# EAGLE design module_ESP07 (EAGLE 8.4.0)
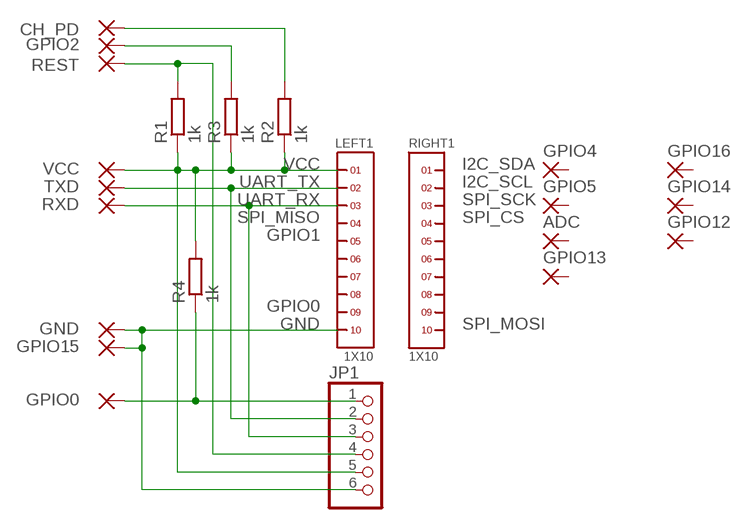
[diagram p0: schematic, sheet 1]

## Parts
ADC  WIREPADSMD1,27-254  [SMD1,27-2,54]
CH_PD  WIREPADSMD1,27-254  [SMD1,27-2,54]
GND  WIREPADSMD1,27-254  [SMD1,27-2,54]
GPIO0  WIREPADSMD1,27-254  [SMD1,27-2,54]
GPIO2  WIREPADSMD1,27-254  [SMD1,27-2,54]
GPIO4  WIREPADSMD1,27-254  [SMD1,27-2,54]
GPIO5  WIREPADSMD1,27-254  [SMD1,27-2,54]
GPIO12  WIREPADSMD1,27-254  [SMD1,27-2,54]
GPIO13  WIREPADSMD1,27-254  [SMD1,27-2,54]
GPIO14  WIREPADSMD1,27-254  [SMD1,27-2,54]
GPIO15  WIREPADSMD1,27-254  [SMD1,27-2,54]
GPIO16  WIREPADSMD1,27-254  [SMD1,27-2,54]
JP1  PINHD-1X6  [1X06]
LEFT1  1X10  [1X10]
R1  1k  R-EU_R0603  [R0603]
R2  1k  R-EU_R0603  [R0603]
R3  1k  R-EU_R0603  [R0603]
R4  1k  R-EU_R0603  [R0603]
REST  WIREPADSMD1,27-254  [SMD1,27-2,54]
RIGHT1  1X10  [1X10]
RXD  WIREPADSMD1,27-254  [SMD1,27-2,54]
TXD  WIREPADSMD1,27-254  [SMD1,27-2,54]
VCC  WIREPADSMD1,27-254  [SMD1,27-2,54]

## Nets
GND: GND.1(P) GPIO15.1(P) JP1.6 LEFT1.10
GPIO0: GPIO0.1(P) JP1.1 R4.1
N$1: GPIO2.1(P) R3.2
N$2: CH_PD.1(P) R2.2
RST: JP1.4 R1.2 REST.1(P)
UART_RX: JP1.3 LEFT1.3 RXD.1(P)
UART_TX: JP1.2 LEFT1.2 TXD.1(P)
VCC: JP1.5 LEFT1.1 R1.1 R2.1 R3.1 R4.2 VCC.1(P)
Unconnected: ADC.1(P) GPIO4.1(P) GPIO5.1(P) GPIO12.1(P) GPIO13.1(P) GPIO14.1(P) GPIO16.1(P) LEFT1.4 LEFT1.5 LEFT1.6 LEFT1.7 LEFT1.8 LEFT1.9 RIGHT1.1 RIGHT1.2 RIGHT1.3 RIGHT1.4 RIGHT1.5 RIGHT1.6 RIGHT1.7 RIGHT1.8 RIGHT1.9 RIGHT1.10

## Notes on the sheet
- VCC | I2C_SDA
- UART_TX | I2C_SCL
- UART_RX | SPI_SCK
- SPI_MISO | SPI_CS
- GPIO1
- GPIO0
- GND | SPI_MOSI

## Library data of the parts
ADC CH_PD GND GPIO0 GPIO2 GPIO4 GPIO5 GPIO12-GPIO16 REST RXD TXD VCC = wirepad:WIREPAD: Wire PAD connect wire on PCB
JP1 = pinhead:PINHD-1X6: PIN HEADER
LEFT1 RIGHT1 = headers(2mm):1X10
R1-R4 = rcl:R-EU_: RESISTOR, European symbol

## Board
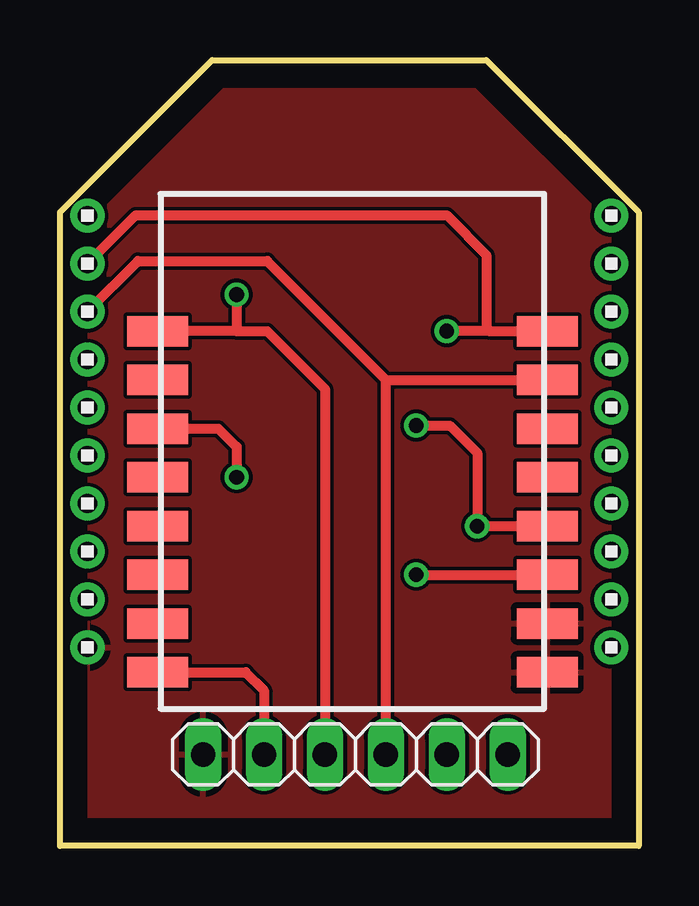
[diagram p1: board, top side]
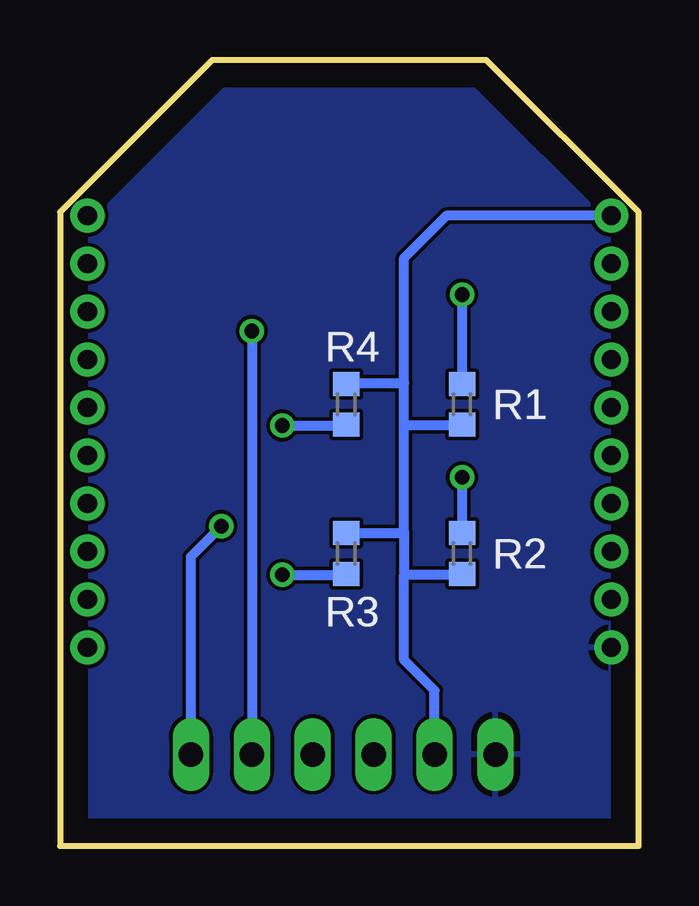
[diagram p2: board, bottom side, seen from below]

Size 24.13 x 32.77 mm. Coordinates in mm from the lower left corner, seen from the top.
Outline: 0,0 0,26.42 6.35,32.77 17.78,32.77 24.13,26.42 24.13,0 0,0
Copper layers (1*16): Top 0.035mm / dielectric 1.5mm / Bottom 0.035mm
Design rules "default": minimum track width 6mil, minimum drill 0.35mm, track to track 6mil, track to pad 6mil, pad to pad 6mil, via to via 6mil, smd to smd 6mil, copper to edge 40mil, drill to drill 6mil, minimum pad ring 10mil, minimum via ring 8mil, stop-mask expansion 4mil, vias tented up to drill 0mil, thermal gap 10mil

### Footprints (pad centres in the part's own frame; a part is rotated, then mirrored left to right if it is on the bottom)
SMD1,27-2,54 = smd 1.27 x 2.54: 1 0,0
1X06 = drill 1.016 long: 1 -6.35,0; 2 -3.81,0; 3 -1.27,0; 4 1.27,0; 5 3.81,0; 6 6.35,0
1X10 = drill 0.8 pad 1.422: 1 -9,0; 2 -7,0; 3 -5,0; 4 -3,0; 5 -1,0; 6 1,0; 7 3,0; 8 5,0; 9 7,0; 10 9,0
R0603 = smd 1 x 1.1: 1 -0.85,0; 2 0.85,0

### Placement (x,y rotation side)
ADC  4.06,19.43 90 top
CH_PD  4.06,17.4 270 top
GND  20.32,7.24 90 top
GPIO0  20.32,13.33 270 top
GPIO2  20.32,11.3 270 top
GPIO4  20.32,17.4 270 top
GPIO5  20.32,15.37 270 top
GPIO12  4.06,11.3 270 top
GPIO13  4.06,9.27 90 top
GPIO14  4.06,13.33 270 top
GPIO15  20.32,9.27 90 top
GPIO16  4.06,15.37 270 top
JP1  12.32,3.81 180 top
LEFT1  1.14,17.27 270 top
R1  7.37,18.42 90 bottom
R2  7.37,12.19 90 bottom
R3  12.19,12.19 270 bottom
R4  12.19,18.42 90 bottom
REST  4.06,21.46 270 top
RIGHT1  22.99,17.27 270 top
RXD  20.32,19.43 270 top
TXD  20.32,21.46 270 top
VCC  4.06,7.24 270 top

### Tracks (layer width: path | path; a pad name or v marks a point on that pad's centre or on a via)
GND
  pour Top: -0.25,-0.25 24.38,-0.25 24.38,26.54 17.91,33.02 6.22,33.02 -0.25,26.54
  pour Bottom: -0.51,-0.51 24.64,-0.51 24.64,26.67 18.03,33.27 6.1,33.27 -0.51,26.67
GPIO0  (via drill 0.61)
  Top 0.406: GPIO0.1 v17.4,13.33 17.4,16.38 16.26,17.53 v14.86,17.53
  Bottom 0.406: JP1.1 18.67,12.06 v17.4,13.33 | v14.86,17.53 12.23,17.53 R4.1
N$1  (via drill 0.61)
  Top 0.406: v14.86,11.3 GPIO2.1
  Bottom 0.406: v14.86,11.3 12.23,11.3 R3.2
N$2  (via drill 0.61)
  Top 0.406: CH_PD.1 6.6,17.4 7.37,16.64 v7.37,15.37
  Bottom 0.406: v7.37,15.37 R2.2
RST  (via drill 0.61)
  Top 0.406: JP1.4 11.05,19.05 8.64,21.46 7.37,21.46 | 7.37,21.46 REST.1 | v7.37,22.99 7.37,21.46
  Bottom 0.406: v7.37,22.99 R1.2
UART_RX
  Top 0.406: 13.59,19.43 RXD.1 | JP1.3 13.59,19.43 | LEFT1.3 3.25,24.38 8.64,24.38 13.59,19.43
UART_TX  (via drill 0.61)
  Top 0.406: LEFT1.2 3.16,26.29 16.13,26.29 17.78,24.64 17.78,21.59 17.91,21.46 | 17.91,21.46 v16.13,21.46 | 17.91,21.46 TXD.1
  Bottom 0.406: v16.13,21.46 JP1.2
VCC
  Top 0.406: VCC.1 7.75,7.24 8.51,6.48 JP1.5
  Bottom 0.406: LEFT1.1 8.02,26.27 9.78,24.51 9.78,19.3 | 9.78,13.08 9.78,17.53 | 9.78,13.08 9.78,11.3 | 9.78,17.53 9.78,19.3 | 9.78,11.3 9.78,7.75 8.51,6.48 JP1.5 | R2.1 7.41,11.3 9.78,11.3 | R1.1 7.41,17.53 9.78,17.53 | R4.2 12.15,19.3 9.78,19.3 | R3.1 9.82,13.04 9.78,13.08

### Text on the board
_bNames: R4 | R1 | R2 | R3
_tDocu: PWR: / LOG: | 3.3 V / 3.3 V | GND | VCC | RST | RXD | TXD | GPIO0
_bDocu: GND | VCC | RST | RXD | TXD | GPIO0